# Altium schematic sheet nf10_addon.SchDoc: Curso Altium - Ejercicio 1
size A4; Organization: ElectraTraining; Address1: Esc. Politecnica Superior; Address2: Univ. Autonoma de Madrid; Address3: 28049 Madrid; Revision: 1.0; SheetNumber: 1; SheetTotal: 1
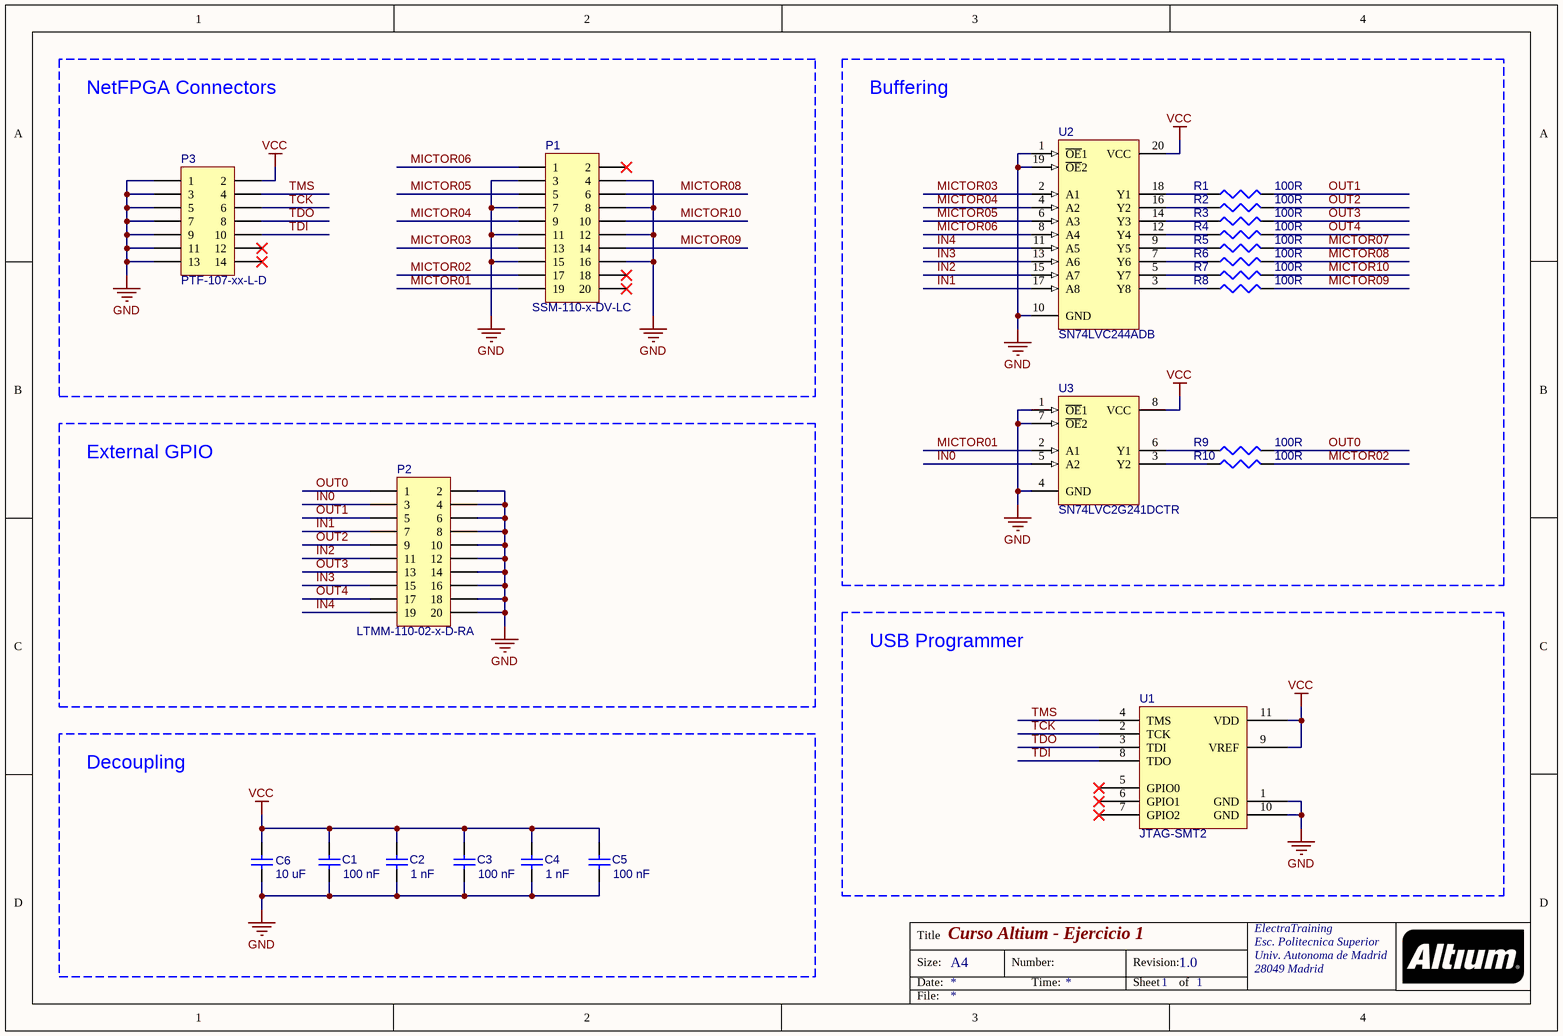
[diagram p0: nf10_addon.SchDoc]

## Parts
C1  value 100 nF  [CAPC0603(1608)100_N]  (hidden comment: Cap)
C2  value 1 nF  [CAPC0603(1608)100_N]  (hidden comment: Cap)
C3  value 100 nF  [CAPC0603(1608)100_N]  (hidden comment: Cap)
C4  value 1 nF  [CAPC0603(1608)100_N]  (hidden comment: Cap)
C5  value 100 nF  [CAPC0603(1608)100_N]  (hidden comment: Cap)
C6  value 10 uF  [CAPC1206(3216)100_N]  (hidden comment: Cap)
P1  SSM-110-x-DV-LC  [SSM-110-X-DV-LC]
P2  LTMM-110-02-x-D-RA  [LTMM-110-02-X-D-RA]
P3  PTF-107-xx-L-D  [PTF-107-XX-L-D]
R1  value 100R  [RESC0603(1608)_N]  (hidden comment: Res3)
R2  value 100R  [RESC0603(1608)_N]  (hidden comment: Res3)
R3  value 100R  [RESC0603(1608)_N]  (hidden comment: Res3)
R4  value 100R  [RESC0603(1608)_N]  (hidden comment: Res3)
R5  value 100R  [RESC0603(1608)_N]  (hidden comment: Res3)
R6  value 100R  [RESC0603(1608)_N]  (hidden comment: Res3)
R7  value 100R  [RESC0603(1608)_N]  (hidden comment: Res3)
R8  value 100R  [RESC0603(1608)_N]  (hidden comment: Res3)
R9  value 100R  [RESC0603(1608)_N]  (hidden comment: Res3)
R10  value 100R  [RESC0603(1608)_N]  (hidden comment: Res3)
U1  JTAG-SMT2  [JTAG-SMT2]
U2  SN74LVC244ADB  [DB020_N]
U3  SN74LVC2G241DCTR  [DCT08_N]

## Blocks framed on the sheet
NetFPGA Connectors: P1 P3
Buffering: R1-R10 U2 U3
External GPIO: P2
USB Programmer: U1
Decoupling: C1-C6

## Nets
GND: C1.1 C2.1 C3.1 C4.1 C5.1 C6.1 P1.3 P1.4 P1.7 P1.8 P1.11 P1.12 P1.15 P1.16 P2.2 P2.4 P2.6 P2.8 P2.10 P2.12 P2.14 P2.16 P2.18 P2.20 P3.1 P3.3 P3.5 P3.7 P3.9 P3.11 P3.13 U1.1(GND) U1.10(GND) U2.1(~{OE}1) U2.10(GND) U2.19(~{OE}2) U3.1(~{OE}1) U3.4(GND) U3.7(~{OE}2)
VCC: C1.2 C2.2 C3.2 C4.2 C5.2 C6.2 P3.2 U1.9(VREF) U1.11(VDD) U2.20(VCC) U3.8(VCC)
IN0: P2.3 U3.5(A2)
IN1: P2.7 U2.17(A8)
IN2: P2.11 U2.15(A7)
IN3: P2.15 U2.13(A6)
IN4: P2.19 U2.11(A5)
MICTOR01: P1.19 U3.2(A1)
MICTOR02: P1.17 R10.2
MICTOR03: P1.13 U2.2(A1)
MICTOR04: P1.9 U2.4(A2)
MICTOR05: P1.5 U2.6(A3)
MICTOR06: P1.1 U2.8(A4)
MICTOR07: R5.2
MICTOR08: P1.6 R6.2
MICTOR09: P1.14 R8.2
MICTOR10: P1.10 R7.2
OUT0: P2.1 R9.2
OUT1: P2.5 R1.2
OUT2: P2.9 R2.2
OUT3: P2.13 R3.2
OUT4: P2.17 R4.2
TCK: P3.6 U1.2(TCK)
TDI: P3.10 U1.8(TDO)
TDO: P3.8 U1.3(TDI)
TMS: P3.4 U1.4(TMS)
NetR1_1: R1.1 U2.18(Y1)
NetR2_1: R2.1 U2.16(Y2)
NetR3_1: R3.1 U2.14(Y3)
NetR4_1: R4.1 U2.12(Y4)
NetR5_1: R5.1 U2.9(Y5)
NetR6_1: R6.1 U2.7(Y6)
NetR7_1: R7.1 U2.5(Y7)
NetR8_1: R8.1 U2.3(Y8)
NetR9_1: R9.1 U3.6(Y1)
NetR10_1: R10.1 U3.3(Y2)

Not connected (* = marked no-connect by the designer): P1 2* 18* 20*; P3 12* 14*; U1 5(GPIO0)* 6(GPIO1)* 7(GPIO2)*

## Notes on the sheet
- Title
- Size:
- Date:
- A4
- Number:
- Time:
- Revision:
- Sheet
- of
- File:

## Library data of the parts
C1-C6 = Cap: Capacitor; Published: 8-Jun-2000; LatestRevisionDate: 17-Jul-2002; LatestRevisionNote: Re-released for DXP Platform.; PackageReference: RAD-0.3; Publisher: Altium Limited; PackageDescription: Radial Cap, Thru-Hole; 2 Leads; 0.3 in Pin Spacing
P1 = SSM-110-x-DV-LC: Samtec SSM-110-x-DV-LC; LatestRevisionDate: 17-Jul-2002; LatestRevisionNote: Re-released for DXP Platform.; Publisher: Altium Limited
P2 = LTMM-110-02-x-D-RA: Samtec LTMM-110-02-x-D-RA; LatestRevisionDate: 17-Jul-2002; LatestRevisionNote: Re-released for DXP Platform.; Publisher: Altium Limited
P3 = PTF-107-xx-L-D: Samtec PTF-107-xx-L-D; LatestRevisionDate: 17-Jul-2002; LatestRevisionNote: Re-released for DXP Platform.; Publisher: Altium Limited
R1-R10 = Res3: Resistor; Published: 8-Jun-2000; LatestRevisionDate: 29-May-2009; LatestRevisionNote: IPC-7351 Footprint Added.; PackageReference: J1-0603; Publisher: Altium Limited; PackageDescription: Chip Resistor
U1 = JTAG_SMT2
U2 = SN74LVC244ADB: Octal Buffer/Driver with 3-State Outputs; Published: 8-Jun-2000; LatestRevisionDate: 16-Oct-2006; LatestRevisionNote: IPC-7351 Footprint Added.; DatasheetVersion: Apr-1999; PackageVersion: May-1999; PackageReference: DB020; Publisher: Altium Limited; PackageDescription: 20-Pin Plastic Small Outline Package 0.65 mm Pitch; Code_JEDEC: MO-150-AE; Code_IPC: SOP65P780-20; ComponentLink1Description: Manufacturer Link; ComponentLink1URL: http://www.ti.com/; ComponentLink2Description: Datasheet; ComponentLink2URL: http://www-s.ti.com/sc/ds/sn74lvc244a.pdf
U3 = SN74LVC2G241DCTR: Quadruple Bus Buffer Gate with 3- State Outputs; Published: 8-Jun-2000; LatestRevisionDate: 06-Jun-2005; LatestRevisionNote: Stylized 3D Model Added.; DatasheetVersion: May-1997; PackageVersion: Jan-1995; PackageReference: W014; Publisher: Altium Limited; PackageDescription: DFP; 14 Leads; Body 9.9 x 6.6 mm (LxW max); Pitch 1.27 mm; Code_JEDEC: MO-092-AB; ComponentLink1Description: Manufacturer Link; ComponentLink1URL: http://www.ti.com/; ComponentLink2Description: Datasheet; ComponentLink2URL: http://www-s.ti.com/sc/ds/sn54abt125.pdf